# EAGLE schematic M882 (EAGLE 6.6.0)
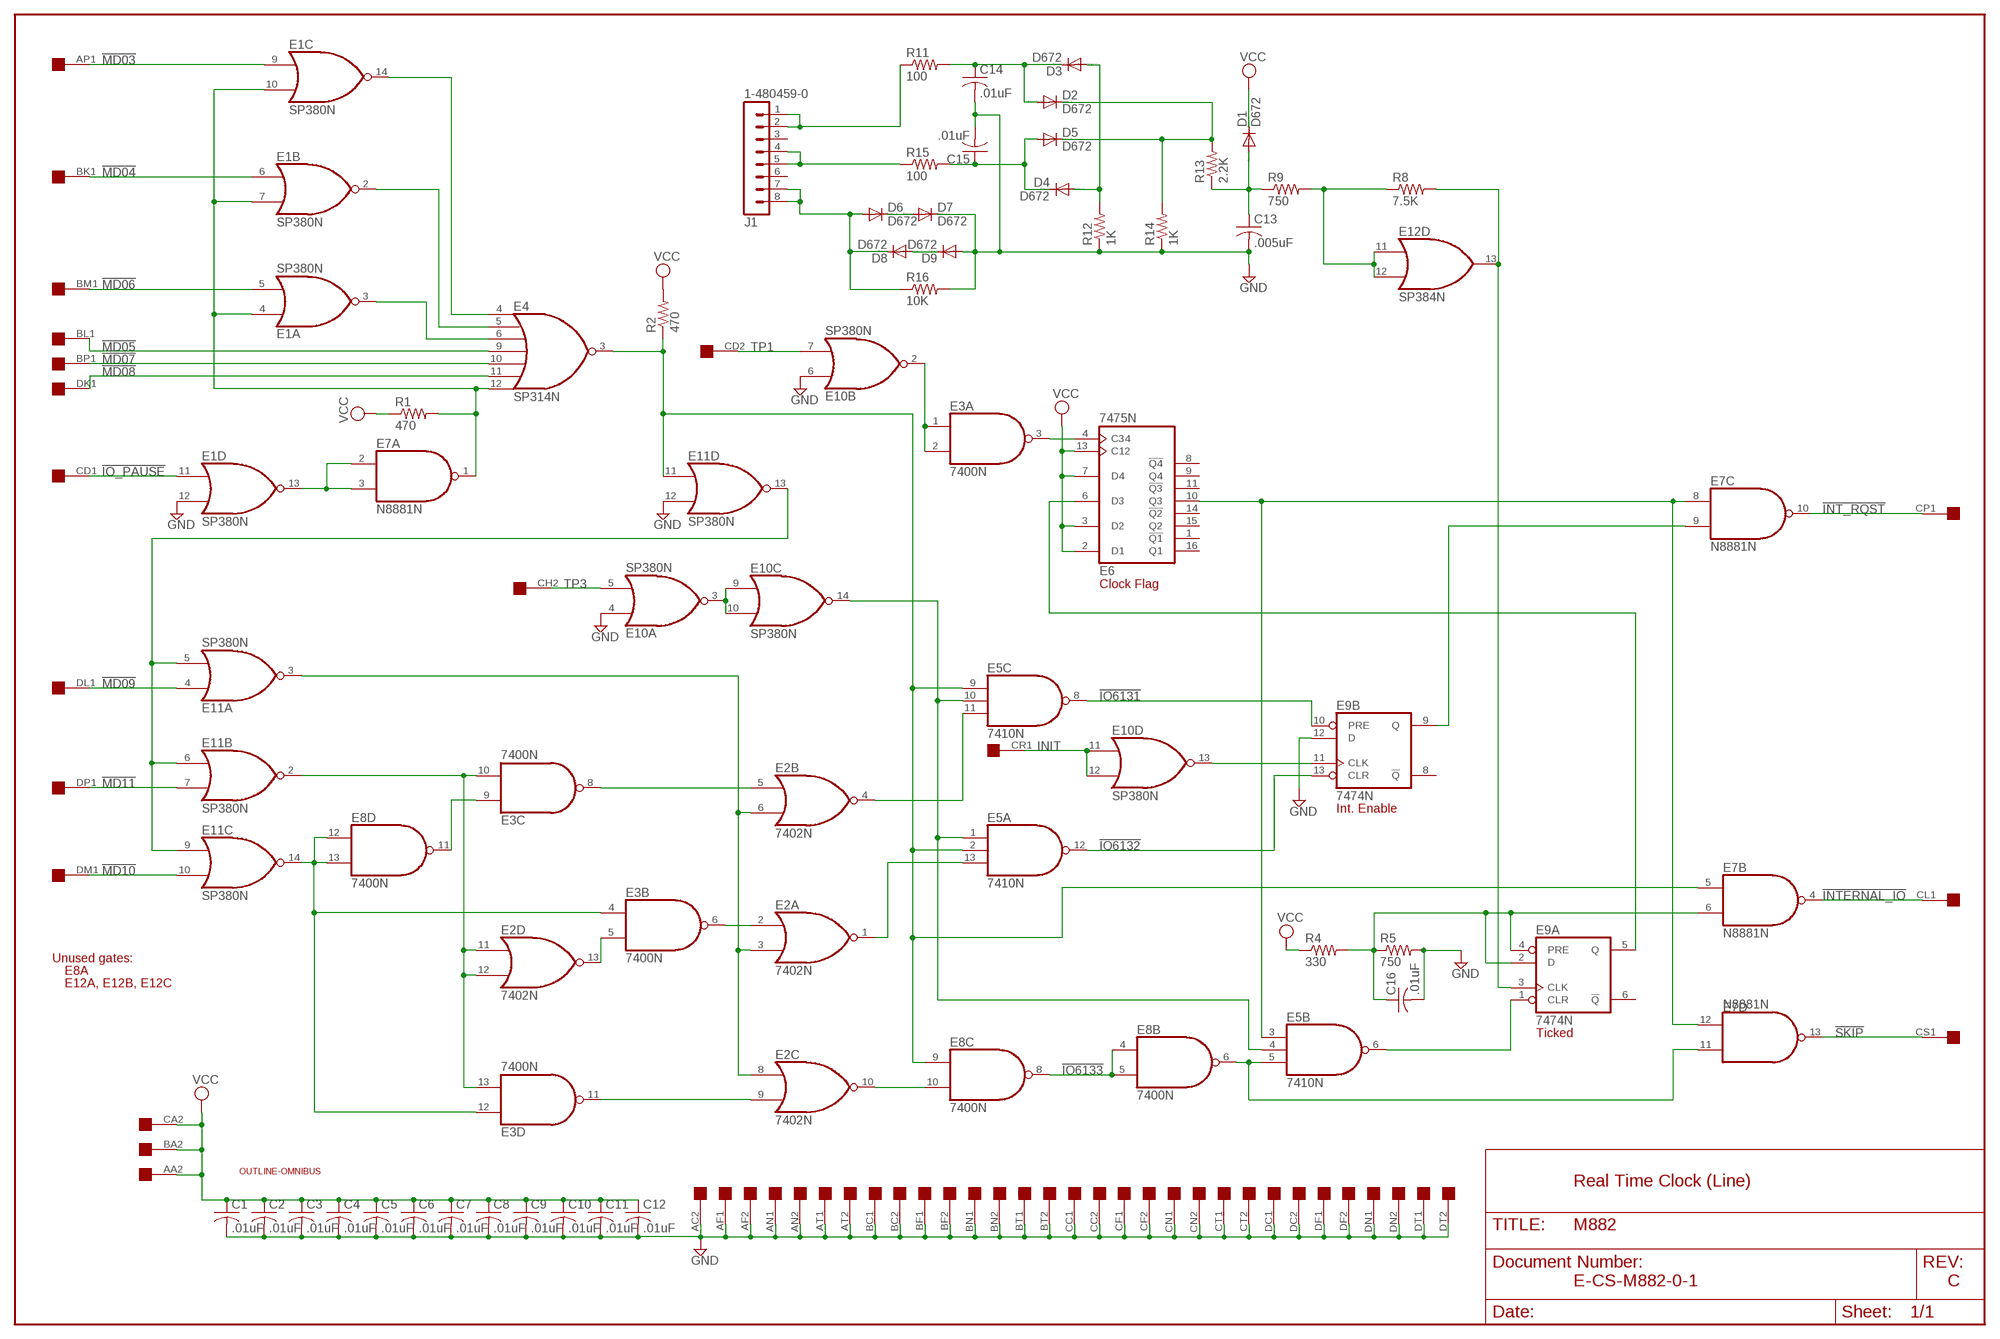
[diagram p0: schematic, sheet 1]

## Parts
C1  .01uF  C-US050-025X075  [C050-025X075]
C2  .01uF  C-US050-025X075  [C050-025X075]
C3  .01uF  C-US050-025X075  [C050-025X075]
C4  .01uF  C-US050-025X075  [C050-025X075]
C5  .01uF  C-US050-025X075  [C050-025X075]
C6  .01uF  C-US050-025X075  [C050-025X075]
C7  .01uF  C-US050-025X075  [C050-025X075]
C8  .01uF  C-US050-025X075  [C050-025X075]
C9  .01uF  C-US050-025X075  [C050-025X075]
C10  .01uF  C-US050-025X075  [C050-025X075]
C11  .01uF  C-US050-025X075  [C050-025X075]
C12  .01uF  C-US050-025X075  [C050-025X075]
C13  .005uF  C-US050-025X075  [C050-025X075]
C14  .01uF  C-US050-025X075  [C050-025X075]
C15  .01uF  C-US050-025X075  [C050-025X075]
C16  .01uF  C-US050-025X075  [C050-025X075]
D1  D672  1N4148DO35-10  [DO35-10]
D2  D672  1N4148DO35-10  [DO35-10]
D3  D672  1N4148DO35-10  [DO35-10]
D4  D672  1N4148DO35-10  [DO35-10]
D5  D672  1N4148DO35-10  [DO35-10]
D6  D672  1N4148DO35-10  [DO35-10]
D7  D672  1N4148DO35-10  [DO35-10]
D8  D672  1N4148DO35-10  [DO35-10]
D9  D672  1N4148DO35-10  [DO35-10]
E1  SP380N  [DIL14]
E2  7402N  [DIL14]
E3  7400N  [DIL14]
E4  SP314N  [DIL14]
E5  7410N  [DIL14]
E6  7475N  [DIL16]
E7  N8881N  [DIL14]
E8  7400N  [DIL14]
E9  7474N  74S74N  [DIL14]
E10  SP380N  [DIL14]
E11  SP380N  [DIL14]
E12  SP384N  [DIL14]
EDGE  QUAD  [EDGE-CON8]
J1  1-480459-0  [1-480459-0]
R1  470  R-US_0207/10  [0207/10]
R2  470  R-US_0207/10  [0207/10]
R4  330  R-US_0207/10  [0207/10]
R5  750  R-US_0207/10  [0207/10]
R8  7.5K  R-US_0207/10  [0207/10]
R9  750  R-US_0207/10  [0207/10]
R11  100  R-US_0207/10  [0207/10]
R12  1K  R-US_0207/10  [0207/10]
R13  2.2K  R-US_0207/10  [0207/10]
R14  1K  R-US_0207/10  [0207/10]
R15  100  R-US_0207/10  [0207/10]
R16  10K  R-US_0207/10  [0207/10]
U$1  OUTLINE-OMNIBUS  [OMNIBUS]

## Nets
!BIOPAUSE: E1.4(A:I0) E1.7(B:I1) E1.10(C:I1) E4.12(I6) E7.1(A:O) R1.2
!DO_CLSK: E5.6(B:O) E9.1(A:CLR)
!INIT: E9.11(B:CLK) E10.13(D:O)
!INT_RQST: E7.10(C:O) EDGE.CP1
!INTERNAL_IO: E7.4(B:O) EDGE.CL1
!IO6131: E5.8(C:O) E9.10(B:PRE)
!IO6132: E5.12(A:O) E9.13(B:CLR)
!IO6133: E8.4(B:I0) E8.5(B:I1) E8.8(C:O)
!IO_PAUSE: E1.11(D:I0) EDGE.CD1
!MAYBE_CLEI: E2.5(B:I0) E3.8(C:O)
!MAYBE_CLSK: E2.9(C:I1) E3.11(D:O)
!MAYBECLDI: E2.2(A:I0) E3.6(B:O)
!MD03: E1.9(C:I0) EDGE.AP1
!MD04: E1.6(B:I0) EDGE.BK1
!MD05: E4.9(I3) EDGE.BL1
!MD06: E1.5(A:I1) EDGE.BM1
!MD07: E4.10(I4) EDGE.BP1
!MD08: E4.11(I5) EDGE.DK1
!MD09: E11.4(A:I0) EDGE.DL1
!MD10: E11.10(C:I1) EDGE.DM1
!MD11: E11.7(B:I1) EDGE.DP1
!MYIOT: E11.5(A:I1) E11.6(B:I0) E11.9(C:I0) E11.13(D:O)
!MYMD10: E3.9(C:I0) E8.11(D:O)
!MYMD11: E2.13(D:O) E3.5(B:I1)
!SKIP: E7.13(D:O) EDGE.CS1
!TP1: E3.1(A:I0) E3.2(A:I1) E10.2(B:O)
!TP3: E10.3(A:O) E10.9(C:I0) E10.10(C:I1)
+3V3: C16.1 E7.6(B:I1) E9.2(A:D) E9.4(A:PRE) R4.2 R5.1
BOSCIN: E9.3(A:CLK) E12.13(D:O) R8.2
BTP1: E3.3(A:O) E6.4(C34)
BTP3: E5.1(A:I0) E5.4(B:I1) E5.10(C:I1) E10.14(C:O)
CK_FLAG: E5.3(B:I0) E6.10(Q3) E7.8(C:I0) E7.12(D:I1)
CLDI: E2.1(A:O) E5.13(A:I2)
CLIE: E2.4(B:O) E5.11(C:I2)
CLSK: E2.10(C:O) E8.10(C:I1)
GND: C1.2 C2.2 C3.2 C4.2 C5.2 C6.2 C7.2 C8.2 C9.2 C10.2 C11.2 C12.2 C13.2 C14.2 C15.2 C16.2 D7.C D9.A E1.12(D:I1) E9.12(B:D) E10.4(A:I0) E10.6(B:I0) E11.12(D:I1) EDGE.AC2 EDGE.AF1 EDGE.AF2 EDGE.AN1 EDGE.AN2 EDGE.AT1 EDGE.AT2 EDGE.BC1 EDGE.BC2 EDGE.BF1 EDGE.BF2 EDGE.BN1 EDGE.BN2 EDGE.BT1 EDGE.BT2 EDGE.CC1 EDGE.CC2 EDGE.CF1 EDGE.CF2 EDGE.CN1 EDGE.CN2 EDGE.CT1 EDGE.CT2 EDGE.DC1 EDGE.DC2 EDGE.DF1 EDGE.DF2 EDGE.DN1 EDGE.DN2 EDGE.DT1 EDGE.DT2 R5.2 R12.1 R14.1 R16.2
INIT: E10.11(D:I0) E10.12(D:I1) EDGE.CR1
IO6133: E5.5(B:I2) E7.11(D:I0) E8.6(B:O)
IO_PAUSE: E1.13(D:O) E7.2(A:I0) E7.3(A:I1)
IOPMD03: E1.14(C:O) E4.4(I0)
IOPMD04: E1.2(B:O) E4.5(I1)
IOPMD06: E1.3(A:O) E4.6(I2)
IRQ_ENABLE: E7.9(C:I1) E9.9(B:Q)
MYIOT: E4.3(O) E5.2(A:I1) E5.9(C:I0) E7.5(B:I0) E8.9(C:I0) E11.11(D:I0) R2.1
MYMD09: E2.3(A:I1) E2.6(B:I1) E2.8(C:I0) E11.3(A:O)
MYMD10: E3.4(B:I0) E3.12(D:I0) E8.12(D:I0) E8.13(D:I1) E11.14(C:O)
MYMD11: E2.11(D:I0) E2.12(D:I1) E3.10(C:I1) E3.13(D:I1) E11.2(B:O)
N$9: J1.1 J1.2 R11.1
N$12: J1.4 J1.5 R15.1
N$20: D6.A D8.C J1.7 J1.8 R16.1
N$48: D6.C D7.A
N$52: D8.A D9.C
N$55: D2.C D5.C R13.2 R14.2
N$56: C14.1 D2.A D3.C R11.2
N$57: D3.A D4.A R12.2
N$58: C13.1 D1.A R9.1 R13.1
N$62: C15.1 D4.C D5.A R15.2
OSCIN: E12.11(D:I0) E12.12(D:I1) R8.1 R9.2
TICKED: E6.6(D3) E9.5(A:Q)
TP1: E10.7(B:I1) EDGE.CD2
TP3: E10.5(A:I1) EDGE.CH2
VCC: C1.1 C2.1 C3.1 C4.1 C5.1 C6.1 C7.1 C8.1 C9.1 C10.1 C11.1 C12.1 D1.C E6.2(D1) E6.3(D2) E6.7(D4) E6.13(C12) EDGE.AA2 EDGE.BA2 EDGE.CA2 R1.1 R2.2 R4.1
Unconnected: E6.1(!Q1) E6.8(!Q4) E6.9(Q4) E6.11(!Q3) E6.14(!Q2) E6.15(Q2) E6.16(Q1) E8.1(A:I0) E8.2(A:I1) E8.3(A:O) E9.6(A:!Q) E9.8(B:!Q) E12.2(B:O) E12.3(A:O) E12.4(A:I0) E12.5(A:I1) E12.6(B:I0) E12.7(B:I1) E12.9(C:I0) E12.10(C:I1) E12.14(C:O) EDGE.AA1 EDGE.AB1 EDGE.AB2 EDGE.AC1 EDGE.AD1 EDGE.AD2 EDGE.AE1 EDGE.AE2 EDGE.AH1 EDGE.AH2 EDGE.AJ1 EDGE.AJ2 EDGE.AK1 EDGE.AK2 EDGE.AL1 EDGE.AL2 EDGE.AM1 EDGE.AM2 EDGE.AP2 EDGE.AR1 EDGE.AR2 EDGE.AS1 EDGE.AS2 EDGE.AU1 EDGE.AU2 EDGE.AV1 EDGE.AV2 EDGE.BA1 EDGE.BB1 EDGE.BB2 EDGE.BD1 EDGE.BD2 EDGE.BE1 EDGE.BE2 EDGE.BH1 EDGE.BH2 EDGE.BJ1 EDGE.BJ2 EDGE.BK2 EDGE.BL2 EDGE.BM2 EDGE.BP2 EDGE.BR1 EDGE.BR2 EDGE.BS1 EDGE.BS2 EDGE.BU1 EDGE.BU2 EDGE.BV1 EDGE.BV2 EDGE.CA1 EDGE.CB1 EDGE.CB2 EDGE.CE1 EDGE.CE2 EDGE.CH1 EDGE.CJ1 EDGE.CJ2 EDGE.CK1 EDGE.CK2 EDGE.CL2 EDGE.CM1 EDGE.CM2 EDGE.CP2 EDGE.CR2 EDGE.CS2 EDGE.CU1 EDGE.CU2 EDGE.CV1 EDGE.CV2 EDGE.DA1 EDGE.DA2 EDGE.DB1 EDGE.DB2 EDGE.DD1 EDGE.DD2 EDGE.DE1 EDGE.DE2 EDGE.DH1 EDGE.DH2 EDGE.DJ1 EDGE.DJ2 EDGE.DK2 EDGE.DL2 EDGE.DM2 EDGE.DP2 EDGE.DR1 EDGE.DR2 EDGE.DS1 EDGE.DS2 EDGE.DU1 EDGE.DU2 EDGE.DV1 EDGE.DV2 J1.3 J1.6

## Notes on the sheet
- Clock Flag
- Int. Enable
- Unused gates:
- E8A
- E12A, E12B, E12C
- Ticked
- Real Time Clock (Line)
- E-CS-M882-0-1 | C

## Power pins joined to a net without a drawn wire
GND: E1.1(P:GND) E2.7(P:GND) E3.7(P:GND) E4.1(GND) E5.7(P:GND) E6.12(GND) E7.7(P:GND) E8.7(P:GND) E9.7(P:GND) E10.1(P:GND) E11.1(P:GND) E12.1(GND)
VCC: E1.8(P:VCC) E2.14(P:VCC) E3.14(P:VCC) E4.8(VCC) E5.14(P:VCC) E6.5(VCC) E7.14(P:VCC) E8.14(P:VCC) E9.14(P:VCC) E10.8(P:VCC) E11.8(P:VCC) E12.8(VCC)

## Library data of the parts
C1-C16 = rcl:C-US: CAPACITOR, American symbol
D1-D9 = diode:1N4148: DIODE high speed (Philips)
E1 E10 E11 = dec-con:SP380: Quad NOR gate (use 8640)
E2 = 74xx-us:74*02: Quad 2-input NOR gate
E3 E8 = 74xx-us:74*00: Quad 2-input NAND gate
E4 = dec-con:SP314: 7-Input NOR gate
E5 = 74xx-us:74*10: Triple 3-input NAND gate
E6 = 74xx-us:74*75: 4-bit bistable LATCH
E7 = dec-con:N8881: Quad 2-input NAND gate, open collector
E9 = 74xx-us:74*74: Dual D type positive edge triggered FLIP FLOP, preset and clear
E12 = dec-con:SP384: Quad OR gate
EDGE = dec-con:QUAD: Quad-Height DEC board
J1 = dec-con:1-480459-0: Mate-N-Lok 1-480459-0, board mounted.
R1 R2 R4 R5 R8 R9 R11-R16 = rcl:R-US_: RESISTOR, American symbol
U$1 = dec-con:OUTLINE-*: Board outlines for DEC boards.

## Net classes
0 default: width 0.813 mm